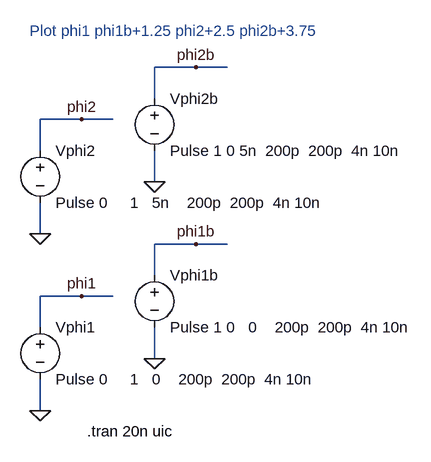
[diagram p0: schematic Fig26_49.asc]
Fig26_49.asc, the LTspice schematic file:
Version 4
SHEET 1 3228 1244
WIRE 1424 160 1360 160
WIRE 1472 160 1424 160
WIRE 1360 208 1360 160
WIRE 1248 240 1184 240
WIRE 1296 240 1248 240
WIRE 1184 288 1184 240
WIRE 1360 336 1360 288
WIRE 1184 416 1184 368
WIRE 1424 432 1360 432
WIRE 1472 432 1424 432
WIRE 1360 480 1360 432
WIRE 1248 512 1184 512
WIRE 1296 512 1248 512
WIRE 1184 560 1184 512
WIRE 1360 608 1360 560
WIRE 1184 688 1184 640
FLAG 1184 688 0
FLAG 1248 512 phi1
FLAG 1360 608 0
FLAG 1424 432 phi1b
FLAG 1184 416 0
FLAG 1248 240 phi2
FLAG 1360 336 0
FLAG 1424 160 phi2b
SYMBOL voltage 1184 544 R0
SYMATTR InstName Vphi1
SYMATTR Value Pulse 0 	1   0    200p  200p  4n 10n
SYMBOL voltage 1360 464 R0
SYMATTR InstName Vphi1b
SYMATTR Value Pulse 1 0   0    200p  200p  4n 10n
SYMBOL voltage 1184 272 R0
SYMATTR InstName Vphi2
SYMATTR Value Pulse 0 	1   5n    200p  200p  4n 10n
SYMBOL voltage 1360 192 R0
SYMATTR InstName Vphi2b
SYMATTR Value Pulse 1 0 5n  200p  200p  4n 10n
TEXT 1256 720 Left 0 !.tran 20n uic
TEXT 1168 104 Left 0 ;Plot phi1 phi1b+1.25 phi2+2.5 phi2b+3.75

The netlist it stands for:
* Fig26_49.asc
Vphi1 phi1 0 Pulse 0 	1   0    200p  200p  4n 10n
Vphi1b phi1b 0 Pulse 1 0   0    200p  200p  4n 10n
Vphi2 phi2 0 Pulse 0 	1   5n    200p  200p  4n 10n
Vphi2b phi2b 0 Pulse 1 0 5n  200p  200p  4n 10n
.tran 20n uic
* Plot phi1 phi1b+1.25 phi2+2.5 phi2b+3.75
.backanno
.end